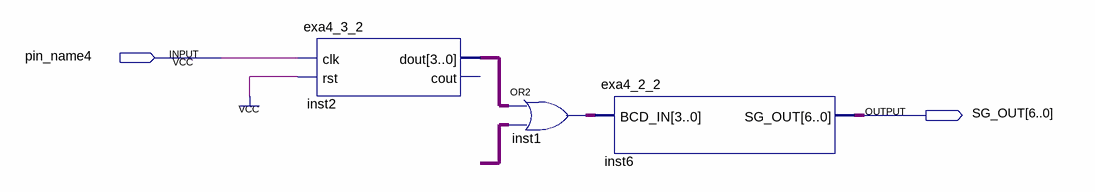
[diagram p0: schematic sheet]
// Quartus schematic Block1.bdf as structural Verilog: 3 symbols, 2 pins
module Block1 (
  input  pin_name4,
  output [6:0] SG_OUT
);

  wire [3:0] inst1_out, inst2_dout, undriven;

  exa4_3_2 inst2 (.clk(pin_name4), .rst(1'b1), .dout(inst2_dout));  // open: cout
  assign inst1_out = inst2_dout | undriven;  // OR2 inst1, 4 bits wide
  exa4_2_2 inst6 (.BCD_IN(inst1_out), .SG_OUT(SG_OUT));
endmodule
